# Altium schematic sheet circuit 2019-09-01.SchDoc
size A2
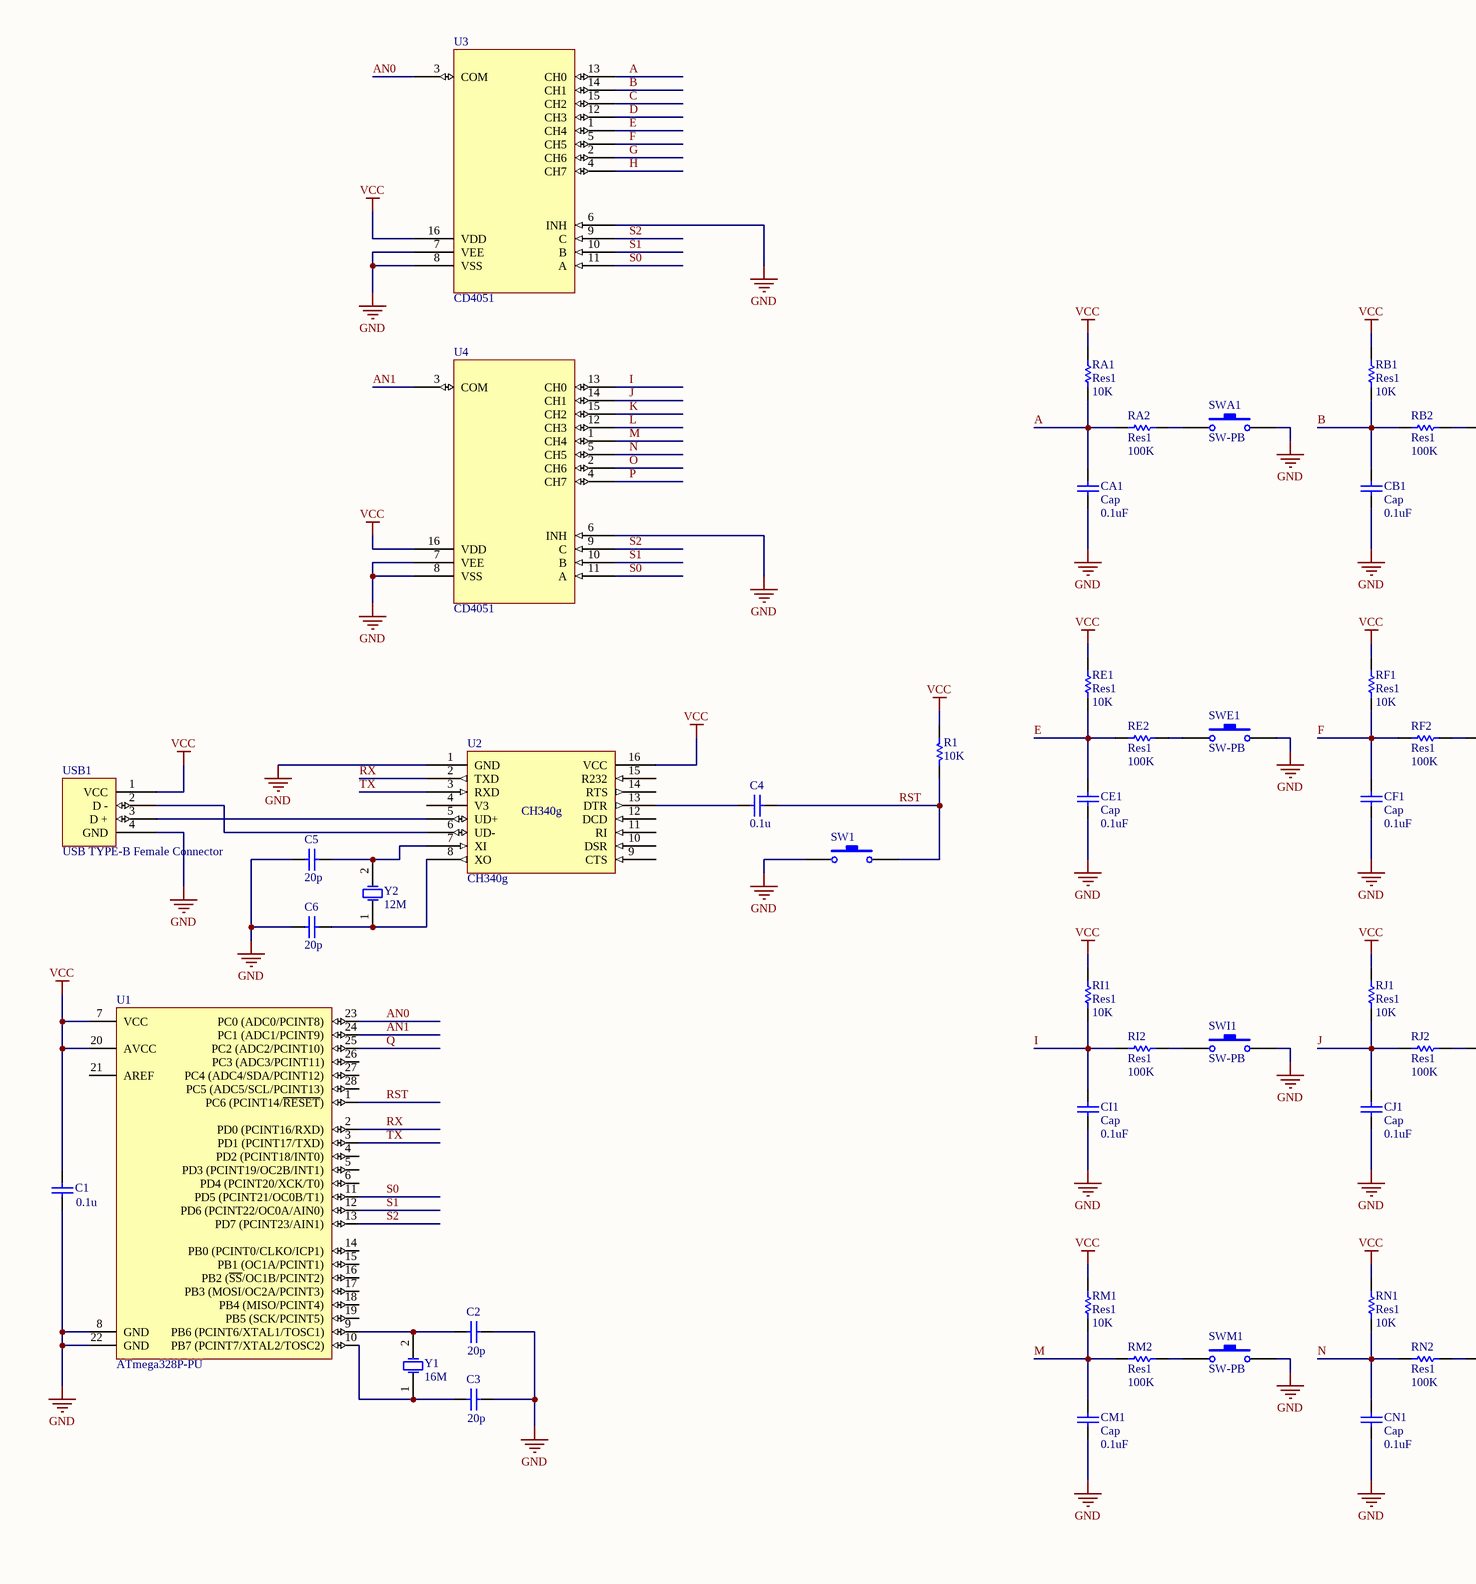
[diagram p0: circuit 2019-09-01.SchDoc, left]
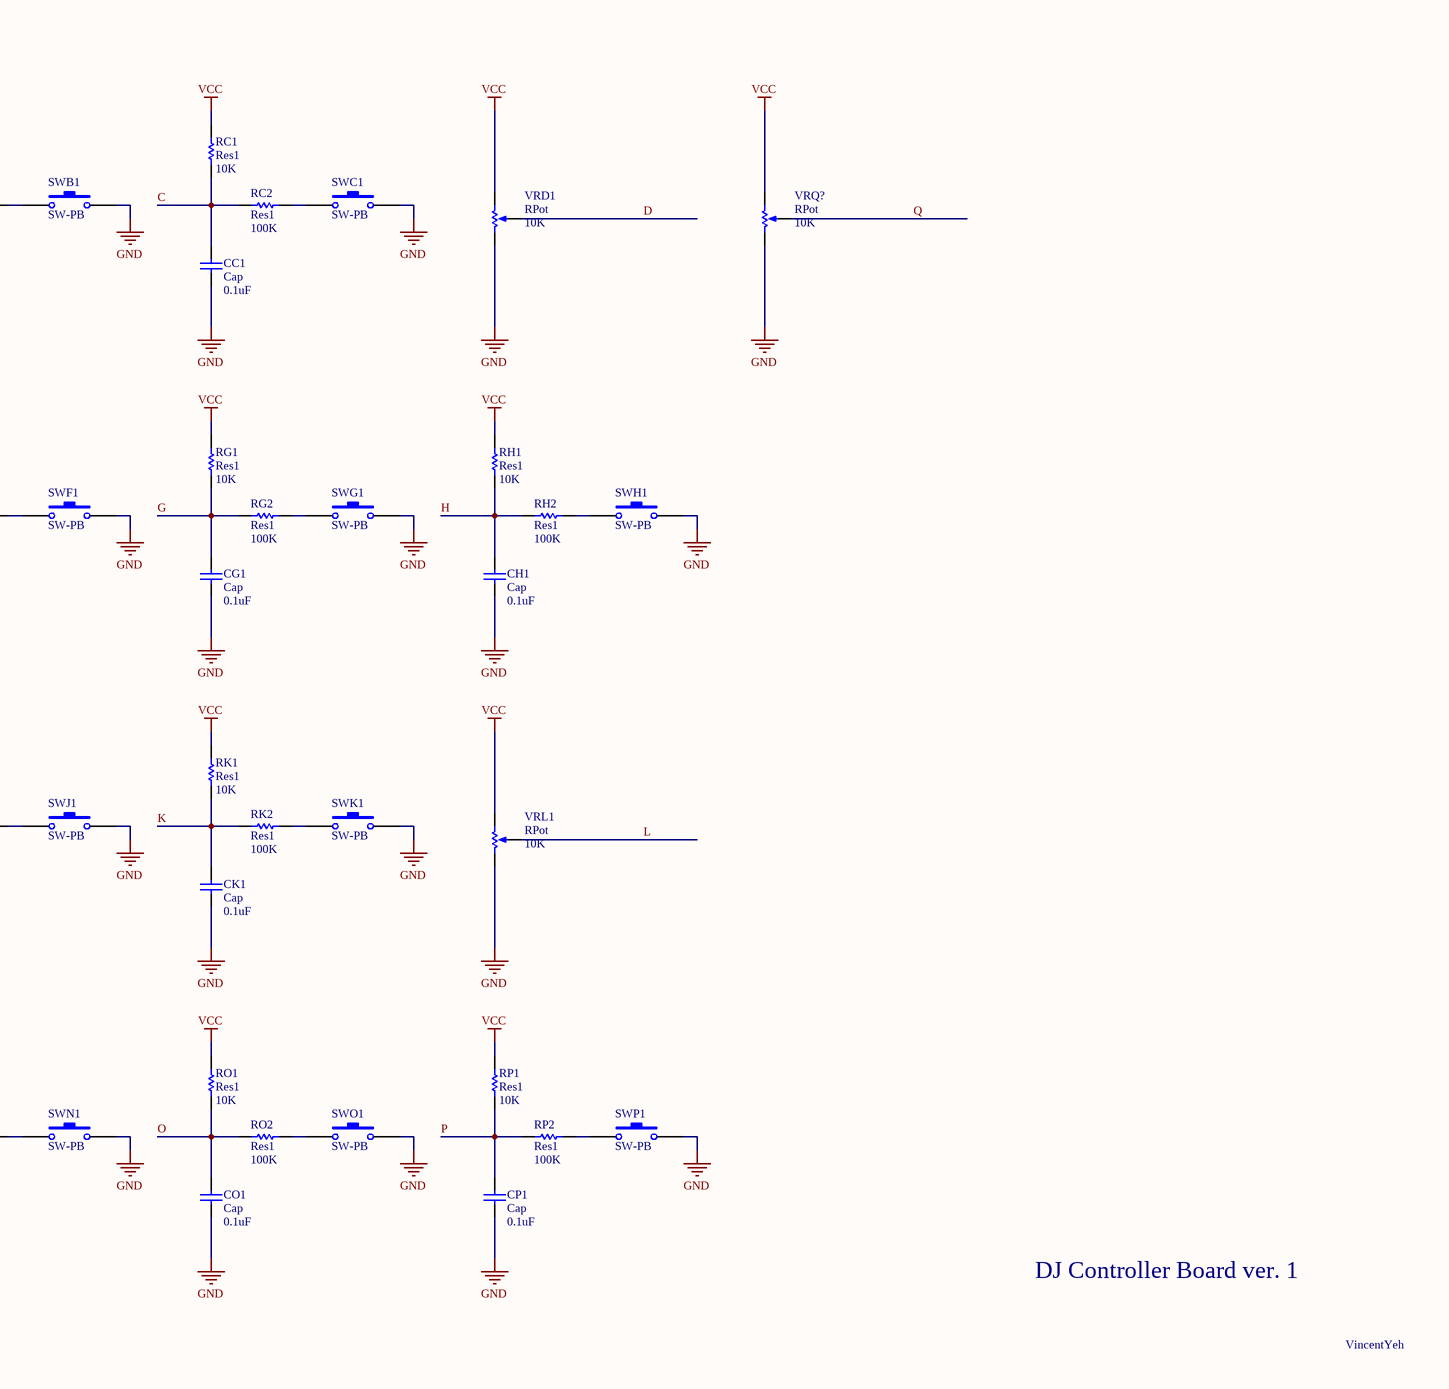
[diagram p1: circuit 2019-09-01.SchDoc, right]

## Parts
C1  value 0.1u  [RAD-0.3]  (hidden comment: Cap)
C2  value 20p  [RAD-0.3]  (hidden comment: Cap)
C3  value 20p  [RAD-0.3]  (hidden comment: Cap)
C4  value 0.1u  [RAD-0.3]  (hidden comment: Cap)
C5  value 20p  [RAD-0.3]  (hidden comment: Cap)
C6  value 20p  [RAD-0.3]  (hidden comment: Cap)
CA1  Cap  value 0.1uF  [RAD-0.3]
CB1  Cap  value 0.1uF  [RAD-0.3]
CC1  Cap  value 0.1uF  [RAD-0.3]
CE1  Cap  value 0.1uF  [RAD-0.3]
CF1  Cap  value 0.1uF  [RAD-0.3]
CG1  Cap  value 0.1uF  [RAD-0.3]
CH1  Cap  value 0.1uF  [RAD-0.3]
CI1  Cap  value 0.1uF  [RAD-0.3]
CJ1  Cap  value 0.1uF  [RAD-0.3]
CK1  Cap  value 0.1uF  [RAD-0.3]
CM1  Cap  value 0.1uF  [RAD-0.3]
CN1  Cap  value 0.1uF  [RAD-0.3]
CO1  Cap  value 0.1uF  [RAD-0.3]
CP1  Cap  value 0.1uF  [RAD-0.3]
R1  value 10K  [AXIAL-0.3]  (hidden comment: Res1)
RA1  Res1  value 10K  [AXIAL-0.3]
RA2  Res1  value 100K  [AXIAL-0.3]
RB1  Res1  value 10K  [AXIAL-0.3]
RB2  Res1  value 100K  [AXIAL-0.3]
RC1  Res1  value 10K  [AXIAL-0.3]
RC2  Res1  value 100K  [AXIAL-0.3]
RE1  Res1  value 10K  [AXIAL-0.3]
RE2  Res1  value 100K  [AXIAL-0.3]
RF1  Res1  value 10K  [AXIAL-0.3]
RF2  Res1  value 100K  [AXIAL-0.3]
RG1  Res1  value 10K  [AXIAL-0.3]
RG2  Res1  value 100K  [AXIAL-0.3]
RH1  Res1  value 10K  [AXIAL-0.3]
RH2  Res1  value 100K  [AXIAL-0.3]
RI1  Res1  value 10K  [AXIAL-0.3]
RI2  Res1  value 100K  [AXIAL-0.3]
RJ1  Res1  value 10K  [AXIAL-0.3]
RJ2  Res1  value 100K  [AXIAL-0.3]
RK1  Res1  value 10K  [AXIAL-0.3]
RK2  Res1  value 100K  [AXIAL-0.3]
RM1  Res1  value 10K  [AXIAL-0.3]
RM2  Res1  value 100K  [AXIAL-0.3]
RN1  Res1  value 10K  [AXIAL-0.3]
RN2  Res1  value 100K  [AXIAL-0.3]
RO1  Res1  value 10K  [AXIAL-0.3]
RO2  Res1  value 100K  [AXIAL-0.3]
RP1  Res1  value 10K  [AXIAL-0.3]
RP2  Res1  value 100K  [AXIAL-0.3]
SW1  SW-PB  [SPST-2]  (value not drawn)
SWA1  SW-PB  [SPST-2]
SWB1  SW-PB  [SPST-2]
SWC1  SW-PB  [SPST-2]
SWE1  SW-PB  [SPST-2]
SWF1  SW-PB  [SPST-2]
SWG1  SW-PB  [SPST-2]
SWH1  SW-PB  [SPST-2]
SWI1  SW-PB  [SPST-2]
SWJ1  SW-PB  [SPST-2]
SWK1  SW-PB  [SPST-2]
SWM1  SW-PB  [SPST-2]
SWN1  SW-PB  [SPST-2]
SWO1  SW-PB  [SPST-2]
SWP1  SW-PB  [SPST-2]
U1  ATmega328P-PU  [28P3]
U2  CH340g
U3  CD4051  [DIP16]
U4  CD4051  [DIP16]
USB1  USB TYPE-B Female Connector
VRD1  RPot  value 10K  [VR5]
VRL1  RPot  value 10K  [VR5]
VRQ?  RPot  value 10K  [VR5]
Y1  16M  [R38]
Y2  12M  [R38]

## Nets
GND: C1.1 C2.2 C3.2 C5.2 C6.2 CA1.1 CB1.1 CC1.1 CE1.1 CF1.1 CG1.1 CH1.1 CI1.1 CJ1.1 CK1.1 CM1.1 CN1.1 CO1.1 CP1.1 SW1.2 SWA1.2 SWB1.2 SWC1.2 SWE1.2 SWF1.2 SWG1.2 SWH1.2 SWI1.2 SWJ1.2 SWK1.2 SWM1.2 SWN1.2 SWO1.2 SWP1.2 U1.8(GND) U1.22(GND) U2.1(GND) U3.6(INH) U3.7(VEE) U3.8(VSS) U4.6(INH) U4.7(VEE) U4.8(VSS) USB1.4(GND) VRD1.2(BOT) VRL1.2(BOT) VRQ?.2(BOT)
VCC: C1.2 R1.2 RA1.2 RB1.2 RC1.2 RE1.2 RF1.2 RG1.2 RH1.2 RI1.2 RJ1.2 RK1.2 RM1.2 RN1.2 RO1.2 RP1.2 U1.7(VCC) U1.20(AVCC) U2.16(VCC) U3.16(VDD) U4.16(VDD) USB1.1(VCC) VRD1.1(TOP) VRL1.1(TOP) VRQ?.1(TOP)
A: CA1.2 RA1.1 RA2.1 U3.13(CH0)
AN0: U1.23(PC0_(ADC0/PCINT8)) U3.3(COM)
AN1: U1.24(PC1_(ADC1/PCINT9)) U4.3(COM)
B: CB1.2 RB1.1 RB2.1 U3.14(CH1)
C: CC1.2 RC1.1 RC2.1 U3.15(CH2)
D: U3.12(CH3) VRD1.3(TAP)
E: CE1.2 RE1.1 RE2.1 U3.1(CH4)
F: CF1.2 RF1.1 RF2.1 U3.5(CH5)
G: CG1.2 RG1.1 RG2.1 U3.2(CH6)
H: CH1.2 RH1.1 RH2.1 U3.4(CH7)
I: CI1.2 RI1.1 RI2.1 U4.13(CH0)
J: CJ1.2 RJ1.1 RJ2.1 U4.14(CH1)
K: CK1.2 RK1.1 RK2.1 U4.15(CH2)
L: U4.12(CH3) VRL1.3(TAP)
M: CM1.2 RM1.1 RM2.1 U4.1(CH4)
N: CN1.2 RN1.1 RN2.1 U4.5(CH5)
O: CO1.2 RO1.1 RO2.1 U4.2(CH6)
P: CP1.2 RP1.1 RP2.1 U4.4(CH7)
Q: U1.25(PC2_(ADC2/PCINT10)) VRQ?.3(TAP)
RST: C4.1 R1.1 SW1.1 U1.1(PC6_(PCINT14/~{RESET}))
RX: U1.2(PD0_(PCINT16/RXD)) U2.2(TXD)
S0: U1.11(PD5_(PCINT21/OC0B/T1)) U3.11(A) U4.11(A)
S1: U1.12(PD6_(PCINT22/OC0A/AIN0)) U3.10(B) U4.10(B)
S2: U1.13(PD7_(PCINT23/AIN1)) U3.9(C) U4.9(C)
TX: U1.3(PD1_(PCINT17/TXD)) U2.3(RXD)
NetC2_1: C2.1 U1.9(PB6_(PCINT6/XTAL1/TOSC1)) Y1.2(OSC2)
NetC3_1: C3.1 U1.10(PB7_(PCINT7/XTAL2/TOSC2)) Y1.1(OSC1)
NetC4_2: C4.2 U2.13(DTR)
NetC5_1: C5.1 U2.7(XI) Y2.2(OSC2)
NetC6_1: C6.1 U2.8(XO) Y2.1(OSC1)
NetRA2_2: RA2.2 SWA1.1
NetRB2_2: RB2.2 SWB1.1
NetRC2_2: RC2.2 SWC1.1
NetRE2_2: RE2.2 SWE1.1
NetRF2_2: RF2.2 SWF1.1
NetRG2_2: RG2.2 SWG1.1
NetRH2_2: RH2.2 SWH1.1
NetRI2_2: RI2.2 SWI1.1
NetRJ2_2: RJ2.2 SWJ1.1
NetRK2_2: RK2.2 SWK1.1
NetRM2_2: RM2.2 SWM1.1
NetRN2_2: RN2.2 SWN1.1
NetRO2_2: RO2.2 SWO1.1
NetRP2_2: RP2.2 SWP1.1
NetU2_5: U2.5(UD+) USB1.3(D_+)
NetU2_6: U2.6(UD-) USB1.2(D_-)

Not connected (* = marked no-connect by the designer): U1 4(PD2_(PCINT18/INT0)) 5(PD3_(PCINT19/OC2B/INT1)) 6(PD4_(PCINT20/XCK/T0)) 14(PB0_(PCINT0/CLKO/ICP1)) 15(PB1_(OC1A/PCINT1)) 16(PB2_(~{SS}/OC1B/PCINT2)) 17(PB3_(MOSI/OC2A/PCINT3)) 18(PB4_(MISO/PCINT4)) 19(PB5_(SCK/PCINT5)) 21(AREF) 26(PC3_(ADC3/PCINT11)) 27(PC4_(ADC4/SDA/PCINT12)) 28(PC5_(ADC5/SCL/PCINT13)); U2 4(V3) 9(CTS) 10(DSR) 11(RI) 12(DCD) 14(RTS) 15(R232)

## Notes on the sheet
- DJ Controller Board ver. 1
- VincentYeh

## Library data of the parts
C1-C6 CA1 CB1 CC1 CE1 CF1 CG1 CH1 CI1 CJ1 CK1 CM1 CN1 CO1 CP1 = Cap: Capacitor; Published: 8-Jun-2000; LatestRevisionDate: 17-Jul-2002; LatestRevisionNote: Re-released for DXP Platform.; PackageReference: RAD-0.3; Publisher: Altium Limited; PackageDescription: Radial Cap, Thru-Hole; 2 Leads; 0.3 in Pin Spacing
R1 RA1 RA2 RB1 RB2 RC1 RC2 RE1 RE2 RF1 RF2 RG1 RG2 RH1 RH2 RI1 RI2 RJ1 RJ2 RK1 RK2 RM1 RM2 RN1 RN2 RO1 RO2 RP1 RP2 = Res1: Resistor; Published: 8-Jun-2000; LatestRevisionDate: 17-Jul-2002; LatestRevisionNote: Re-released for DXP Platform.; PackageReference: AXIAL-0.3; Publisher: Altium Limited; PackageDescription: Axial Device, Thru-Hole; 2 Leads; 0.3 in Pin Spacing
SW1 SWA1 SWB1 SWC1 SWE1 SWF1 SWG1 SWH1 SWI1 SWJ1 SWK1 SWM1 SWN1 SWO1 SWP1 = SW-PB: Switch; Published: 24-Mar-1999; LatestRevisionDate: 17-Jul-2002; LatestRevisionNote: Re-released for DXP Platform.; PackageReference: SPST-2; Publisher: Altium Limited; PackageDescription: Switch; 2 Leads
U1 = ATmega328P-PU: 8-bit AVR Microcontroller, 32KB Flash, 1KB EEPROM, 2KB SRAM, 28-pin PDIP, Industrial Grade (-40蚓 to 85蚓); Published: 1-Apr-2010; DatasheetVersion: revA, Jan-2010; PackageVersion: revB, Sep-2001; PackageReference: 28P3; Publisher: Altium Limited; PackageDescription: 28-lead (0.300"/7.62mm Wide) Plastic Dual Inline Package (PDIP); Supplier 1: Digi-Key; Supplier Part Number 1: ATMEGA328P-PU-ND; Supplier 2: Farnell; Supplier Part Number 2: 1715487; Supplier 3: Mouser; Supplier Part Number 3: 556-ATMEGA328P-PU; ComponentLink1Description: Manufacturer Link; ComponentLink1URL: http://www.atmel.com/products/avr/default.asp?; ComponentLink2Description: ATmega48A/48PA/88A/88PA/168A/168PA/328/328P Datasheet; ComponentLink2URL: http://www.atmel.com/dyn/resources/prod_documents/8271.pdf; ComponentLink3Description: ATmega48A/48PA/88A/88PA/168A/168PA/328/328P Summary; ComponentLink3URL: http://www.atmel.com/dyn/resources/prod_documents/8271S.pdf; ComponentLink4Description: Atmel.com Home; ComponentLink4URL: http://www.atmel.com
U3 U4 = CD4051: CMOS Analog Multiplexers/Demultiplexers  with Logic Level Conversion; Supplier 1: Digi-Key
VRD1 VRL1 VRQ? = RPot: Potentiometer; Sim Note: Enter the Resistance value and the set point into parameter fields.; Set Position: 0.5; Published: 8-Jun-2000; LatestRevisionDate: 17-Jul-2002; LatestRevisionNote: Re-released for DXP Platform.; PackageReference: VR5; Publisher: Altium Limited; PackageDescription: Variable Resistor, Thru-Hole; 3 Leads
Y1 Y2 = XTAL: Crystal Oscillator; Published: 8-Jun-2000; LatestRevisionDate: 17-Jul-2002; LatestRevisionNote: Re-released for DXP Platform.; PackageReference: R38; Publisher: Altium Limited; PackageDescription: Crystal, Thru-Hole; 2 Leads; Body 3.1 x 8.2 mm (Dia.xH)